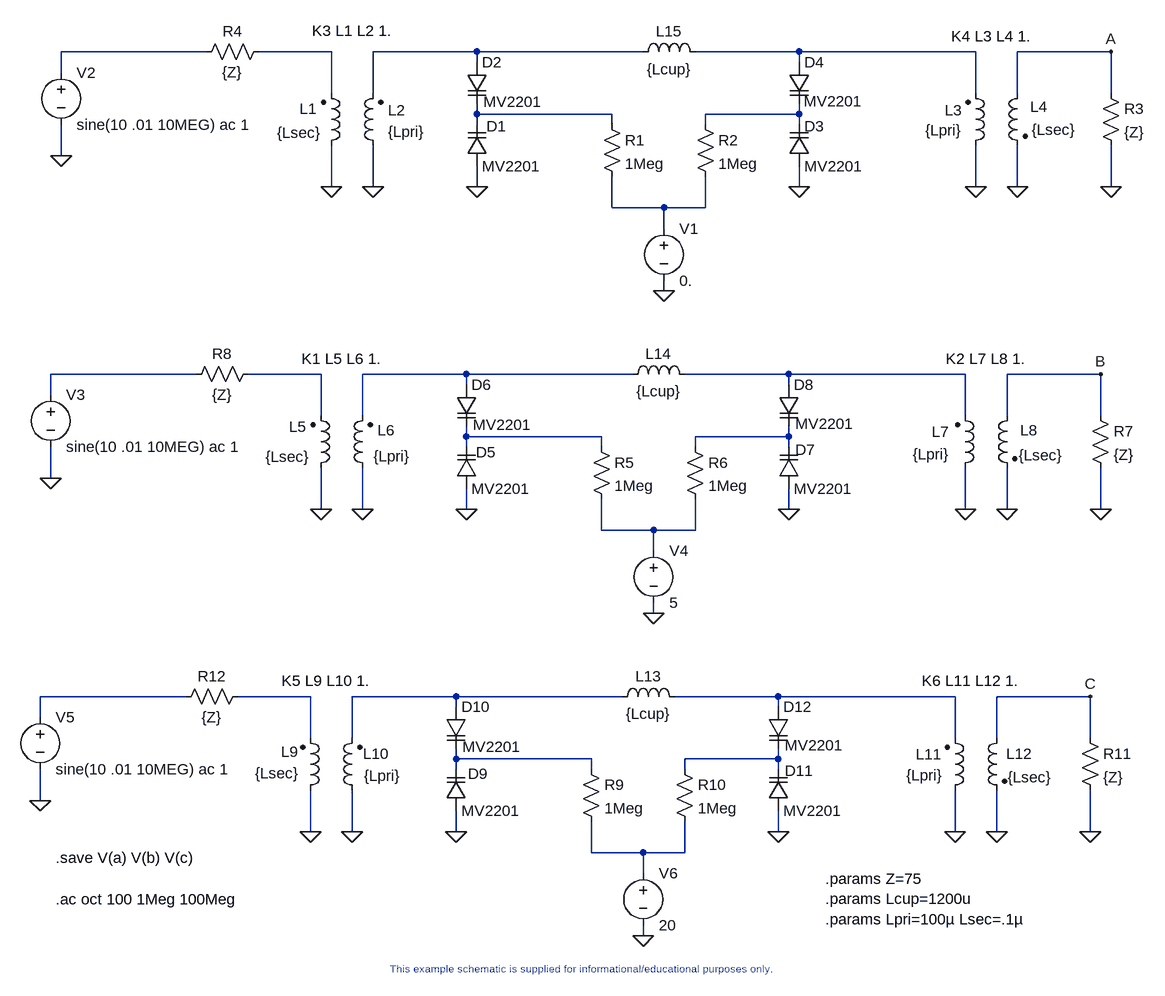
[diagram p0: schematic varactor2.asc]
varactor2.asc, the LTspice schematic file:
Version 4
SHEET 1 3640 2448
WIRE 2176 912 1952 912
WIRE 2368 912 2256 912
WIRE 2592 912 2432 912
WIRE 2848 912 2592 912
WIRE 3088 912 2928 912
WIRE 3360 912 3088 912
WIRE 3568 912 3424 912
WIRE 2592 928 2592 912
WIRE 3088 928 3088 912
WIRE 1952 944 1952 912
WIRE 2368 976 2368 912
WIRE 2432 976 2432 912
WIRE 3360 976 3360 912
WIRE 3424 976 3424 912
WIRE 3568 976 3568 912
WIRE 2592 1008 2592 992
WIRE 2800 1008 2592 1008
WIRE 3088 1008 3088 992
WIRE 3088 1008 2944 1008
WIRE 2592 1024 2592 1008
WIRE 2800 1024 2800 1008
WIRE 2944 1024 2944 1008
WIRE 3088 1024 3088 1008
WIRE 1952 1072 1952 1024
WIRE 2368 1120 2368 1056
WIRE 2432 1120 2432 1056
WIRE 2592 1120 2592 1088
WIRE 3088 1120 3088 1088
WIRE 3360 1120 3360 1056
WIRE 3424 1120 3424 1056
WIRE 3568 1120 3568 1056
WIRE 2800 1152 2800 1104
WIRE 2880 1152 2800 1152
WIRE 2944 1152 2944 1104
WIRE 2944 1152 2880 1152
WIRE 2880 1184 2880 1152
WIRE 2880 1280 2880 1264
WIRE 2160 1408 1936 1408
WIRE 2352 1408 2240 1408
WIRE 2576 1408 2416 1408
WIRE 2832 1408 2576 1408
WIRE 3072 1408 2912 1408
WIRE 3344 1408 3072 1408
WIRE 3552 1408 3408 1408
WIRE 2576 1424 2576 1408
WIRE 3072 1424 3072 1408
WIRE 1936 1440 1936 1408
WIRE 2352 1472 2352 1408
WIRE 2416 1472 2416 1408
WIRE 3344 1472 3344 1408
WIRE 3408 1472 3408 1408
WIRE 3552 1472 3552 1408
WIRE 2576 1504 2576 1488
WIRE 2784 1504 2576 1504
WIRE 3072 1504 3072 1488
WIRE 3072 1504 2928 1504
WIRE 2576 1520 2576 1504
WIRE 2784 1520 2784 1504
WIRE 2928 1520 2928 1504
WIRE 3072 1520 3072 1504
WIRE 1936 1568 1936 1520
WIRE 2352 1616 2352 1552
WIRE 2416 1616 2416 1552
WIRE 2576 1616 2576 1584
WIRE 3072 1616 3072 1584
WIRE 3344 1616 3344 1552
WIRE 3408 1616 3408 1552
WIRE 3552 1616 3552 1552
WIRE 2784 1648 2784 1600
WIRE 2864 1648 2784 1648
WIRE 2928 1648 2928 1600
WIRE 2928 1648 2864 1648
WIRE 2864 1680 2864 1648
WIRE 2864 1776 2864 1760
WIRE 2144 1904 1920 1904
WIRE 2336 1904 2224 1904
WIRE 2560 1904 2400 1904
WIRE 2816 1904 2560 1904
WIRE 3056 1904 2896 1904
WIRE 3328 1904 3056 1904
WIRE 3536 1904 3392 1904
WIRE 2560 1920 2560 1904
WIRE 3056 1920 3056 1904
WIRE 1920 1936 1920 1904
WIRE 2336 1968 2336 1904
WIRE 2400 1968 2400 1904
WIRE 3328 1968 3328 1904
WIRE 3392 1968 3392 1904
WIRE 3536 1968 3536 1904
WIRE 2560 2000 2560 1984
WIRE 2768 2000 2560 2000
WIRE 3056 2000 3056 1984
WIRE 3056 2000 2912 2000
WIRE 2560 2016 2560 2000
WIRE 2768 2016 2768 2000
WIRE 2912 2016 2912 2000
WIRE 3056 2016 3056 2000
WIRE 1920 2064 1920 2016
WIRE 2336 2112 2336 2048
WIRE 2400 2112 2400 2048
WIRE 2560 2112 2560 2080
WIRE 3056 2112 3056 2080
WIRE 3328 2112 3328 2048
WIRE 3392 2112 3392 2048
WIRE 3536 2112 3536 2048
WIRE 2768 2144 2768 2096
WIRE 2848 2144 2768 2144
WIRE 2912 2144 2912 2096
WIRE 2912 2144 2848 2144
WIRE 2848 2176 2848 2144
WIRE 2848 2272 2848 2256
FLAG 1952 1072 0
FLAG 2592 1120 0
FLAG 3088 1120 0
FLAG 2368 1120 0
FLAG 3424 1120 0
FLAG 3568 1120 0
FLAG 2880 1280 0
FLAG 1936 1568 0
FLAG 2576 1616 0
FLAG 3072 1616 0
FLAG 2352 1616 0
FLAG 3408 1616 0
FLAG 3552 1616 0
FLAG 2864 1776 0
FLAG 1920 2064 0
FLAG 2560 2112 0
FLAG 3056 2112 0
FLAG 2336 2112 0
FLAG 3392 2112 0
FLAG 3536 2112 0
FLAG 2848 2272 0
FLAG 2432 1120 0
FLAG 3360 1120 0
FLAG 3344 1616 0
FLAG 2416 1616 0
FLAG 2400 2112 0
FLAG 3328 2112 0
FLAG 3568 912 A
FLAG 3552 1408 B
FLAG 3536 1904 C
SYMBOL voltage 1952 928 R0
SYMATTR InstName V2
SYMATTR Value sine(10 .01 10MEG) ac 1
SYMBOL varactor 2576 1088 M180
WINDOW 0 31 61 Left 2
WINDOW 3 24 0 Left 2
SYMATTR InstName D1
SYMATTR Value MV2201
SYMBOL varactor 2576 928 R0
WINDOW 3 26 61 Left 2
SYMATTR Value MV2201
SYMATTR InstName D2
SYMBOL ind2 2448 1072 R180
WINDOW 0 -7 70 Right 2
WINDOW 3 -7 37 Right 2
SYMATTR InstName L2
SYMATTR Value {Lpri}
SYMBOL res 2784 1008 R0
SYMATTR InstName R1
SYMATTR Value 1Meg
SYMBOL varactor 3072 1088 M180
WINDOW 0 24 61 Left 2
WINDOW 3 24 0 Left 2
SYMATTR InstName D3
SYMATTR Value MV2201
SYMBOL varactor 3072 928 R0
WINDOW 3 23 60 Left 2
SYMATTR Value MV2201
SYMATTR InstName D4
SYMBOL ind2 3344 1072 M180
WINDOW 0 -5 70 Right 2
WINDOW 3 -5 39 Right 2
SYMATTR InstName L3
SYMATTR Value {Lpri}
SYMBOL res 2928 1008 R0
SYMATTR InstName R2
SYMATTR Value 1Meg
SYMBOL ind2 3440 960 M0
WINDOW 0 -4 37 Right 2
WINDOW 3 -6 72 Right 2
SYMATTR InstName L4
SYMATTR Value {Lsec}
SYMBOL ind2 2352 1072 M180
WINDOW 0 -6 72 Right 2
WINDOW 3 0 35 Right 2
SYMATTR InstName L1
SYMATTR Value {Lsec}
SYMBOL res 3552 960 R0
SYMATTR InstName R3
SYMATTR Value {Z}
SYMBOL res 2272 896 R90
WINDOW 0 0 56 VBottom 2
WINDOW 3 32 56 VTop 2
SYMATTR InstName R4
SYMATTR Value {Z}
SYMBOL voltage 2880 1168 R0
SYMATTR InstName V1
SYMATTR Value 0.
SYMBOL voltage 1936 1424 R0
SYMATTR InstName V3
SYMATTR Value sine(10 .01 10MEG) ac 1
SYMBOL varactor 2560 1584 M180
WINDOW 0 31 56 Left 2
WINDOW 3 24 0 Left 2
SYMATTR InstName D5
SYMATTR Value MV2201
SYMBOL varactor 2560 1424 R0
WINDOW 3 26 62 Left 2
SYMATTR Value MV2201
SYMATTR InstName D6
SYMBOL ind2 2432 1568 R180
WINDOW 0 -7 74 Right 2
WINDOW 3 -1 34 Right 2
SYMATTR InstName L6
SYMATTR Value {Lpri}
SYMBOL res 2768 1504 R0
SYMATTR InstName R5
SYMATTR Value 1Meg
SYMBOL varactor 3056 1584 M180
WINDOW 0 26 60 Left 2
WINDOW 3 24 0 Left 2
SYMATTR InstName D7
SYMATTR Value MV2201
SYMBOL varactor 3056 1424 R0
WINDOW 3 26 60 Left 2
SYMATTR Value MV2201
SYMATTR InstName D8
SYMBOL ind2 3328 1568 M180
WINDOW 0 -9 71 Right 2
WINDOW 3 -8 37 Right 2
SYMATTR InstName L7
SYMATTR Value {Lpri}
SYMBOL res 2912 1504 R0
SYMATTR InstName R6
SYMATTR Value 1Meg
SYMBOL ind2 3424 1456 M0
WINDOW 0 -4 38 Right 2
WINDOW 3 -2 77 Right 2
SYMATTR InstName L8
SYMATTR Value {Lsec}
SYMBOL ind2 2336 1568 M180
WINDOW 0 -6 79 Right 2
WINDOW 3 -2 33 Right 2
SYMATTR InstName L5
SYMATTR Value {Lsec}
SYMBOL res 3536 1456 R0
SYMATTR InstName R7
SYMATTR Value {Z}
SYMBOL res 2256 1392 R90
WINDOW 0 0 56 VBottom 2
WINDOW 3 32 56 VTop 2
SYMATTR InstName R8
SYMATTR Value {Z}
SYMBOL voltage 2864 1664 R0
SYMATTR InstName V4
SYMATTR Value 5
SYMBOL voltage 1920 1920 R0
SYMATTR InstName V5
SYMATTR Value sine(10 .01 10MEG) ac 1
SYMBOL varactor 2544 2080 M180
WINDOW 0 34 57 Left 2
WINDOW 3 24 0 Left 2
SYMATTR InstName D9
SYMATTR Value MV2201
SYMBOL varactor 2544 1920 R0
WINDOW 3 26 61 Left 2
SYMATTR Value MV2201
SYMATTR InstName D10
SYMBOL ind2 2416 2064 R180
WINDOW 0 -1 72 Right 2
WINDOW 3 -2 38 Right 2
SYMATTR InstName L10
SYMATTR Value {Lpri}
SYMBOL res 2752 2000 R0
SYMATTR InstName R9
SYMATTR Value 1Meg
SYMBOL varactor 3040 2080 M180
WINDOW 0 26 62 Left 2
WINDOW 3 24 0 Left 2
SYMATTR InstName D11
SYMATTR Value MV2201
SYMBOL varactor 3040 1920 R0
WINDOW 3 26 59 Left 2
SYMATTR Value MV2201
SYMATTR InstName D12
SYMBOL ind2 3312 2064 M180
WINDOW 0 -4 71 Right 2
WINDOW 3 -2 39 Right 2
SYMATTR InstName L11
SYMATTR Value {Lpri}
SYMBOL res 2896 2000 R0
SYMATTR InstName R10
SYMATTR Value 1Meg
SYMBOL ind2 3408 1952 M0
WINDOW 0 1 40 Right 2
WINDOW 3 -1 76 Right 2
SYMATTR InstName L12
SYMATTR Value {Lsec}
SYMBOL ind2 2320 2064 M180
WINDOW 0 -2 75 Right 2
WINDOW 3 -2 42 Right 2
SYMATTR InstName L9
SYMATTR Value {Lsec}
SYMBOL res 3520 1952 R0
SYMATTR InstName R11
SYMATTR Value {Z}
SYMBOL res 2240 1888 R90
WINDOW 0 0 56 VBottom 2
WINDOW 3 32 56 VTop 2
SYMATTR InstName R12
SYMATTR Value {Z}
SYMBOL voltage 2848 2160 R0
SYMATTR InstName V6
SYMATTR Value 20
SYMBOL ind 2800 1920 R270
WINDOW 0 32 56 VTop 2
WINDOW 3 5 56 VBottom 2
SYMATTR InstName L13
SYMATTR Value {Lcup}
SYMBOL ind 2816 1424 R270
WINDOW 0 32 56 VTop 2
WINDOW 3 5 56 VBottom 2
SYMATTR InstName L14
SYMATTR Value {Lcup}
SYMBOL ind 2832 928 R270
WINDOW 0 32 56 VTop 2
WINDOW 3 5 56 VBottom 2
SYMATTR InstName L15
SYMATTR Value {Lcup}
TEXT 1944 2216 Left 2 !.ac oct 100 1Meg 100Meg
TEXT 2400 880 Center 2 !K3 L1 L2 1.
TEXT 3384 888 Center 2 !K4 L3 L4 1.
TEXT 2384 1384 Center 2 !K1 L5 L6 1.
TEXT 3376 1384 Center 2 !K2 L7 L8 1.
TEXT 2360 1880 Center 2 !K5 L9 L10 1.
TEXT 3352 1880 Center 2 !K6 L11 L12 1.
TEXT 3128 2184 Left 2 !.params Z=75\n.params Lcup=1200u\n.params Lpri=100µ Lsec=.1µ
TEXT 1944 2152 Left 2 !.save V(a) V(b) V(c)
TEXT 2744 2312 Top 1 ;This example schematic is supplied for informational/educational purposes only.

The netlist it stands for:
* varactor2.asc
V2 N001 0 sine(10 .01 10MEG) ac 1
D1 0 N005 MV2201
D2 N003 N005 MV2201
L2 0 N003 {Lpri}
R1 N005 N007 1Meg
D3 0 N006 MV2201
D4 N004 N006 MV2201
L3 0 N004 {Lpri}
R2 N006 N007 1Meg
L4 A 0 {Lsec}
L1 0 N002 {Lsec}
R3 A 0 {Z}
R4 N002 N001 {Z}
V1 N007 0 0.
V3 N008 0 sine(10 .01 10MEG) ac 1
D5 0 N012 MV2201
D6 N010 N012 MV2201
L6 0 N010 {Lpri}
R5 N012 N014 1Meg
D7 0 N013 MV2201
D8 N011 N013 MV2201
L7 0 N011 {Lpri}
R6 N013 N014 1Meg
L8 B 0 {Lsec}
L5 0 N009 {Lsec}
R7 B 0 {Z}
R8 N009 N008 {Z}
V4 N014 0 5
V5 N015 0 sine(10 .01 10MEG) ac 1
D9 0 N019 MV2201
D10 N017 N019 MV2201
L10 0 N017 {Lpri}
R9 N019 N021 1Meg
D11 0 N020 MV2201
D12 N018 N020 MV2201
L11 0 N018 {Lpri}
R10 N020 N021 1Meg
L12 C 0 {Lsec}
L9 0 N016 {Lsec}
R11 C 0 {Z}
R12 N016 N015 {Z}
V6 N021 0 20
L13 N017 N018 {Lcup}
L14 N010 N011 {Lcup}
L15 N003 N004 {Lcup}
.model D D
.lib standard.dio
.ac oct 100 1Meg 100Meg
K3 L1 L2 1.
K4 L3 L4 1.
K1 L5 L6 1.
K2 L7 L8 1.
K5 L9 L10 1.
K6 L11 L12 1.
.params Z=75
.params Lcup=1200u
.params Lpri=100µ Lsec=.1µ
.save V(a) V(b) V(c)
* This example schematic is supplied for informational/educational purposes only.
.backanno
.end